# Altium schematic sheet MasterComm.SchDoc
size A4; SheetNumber: 1
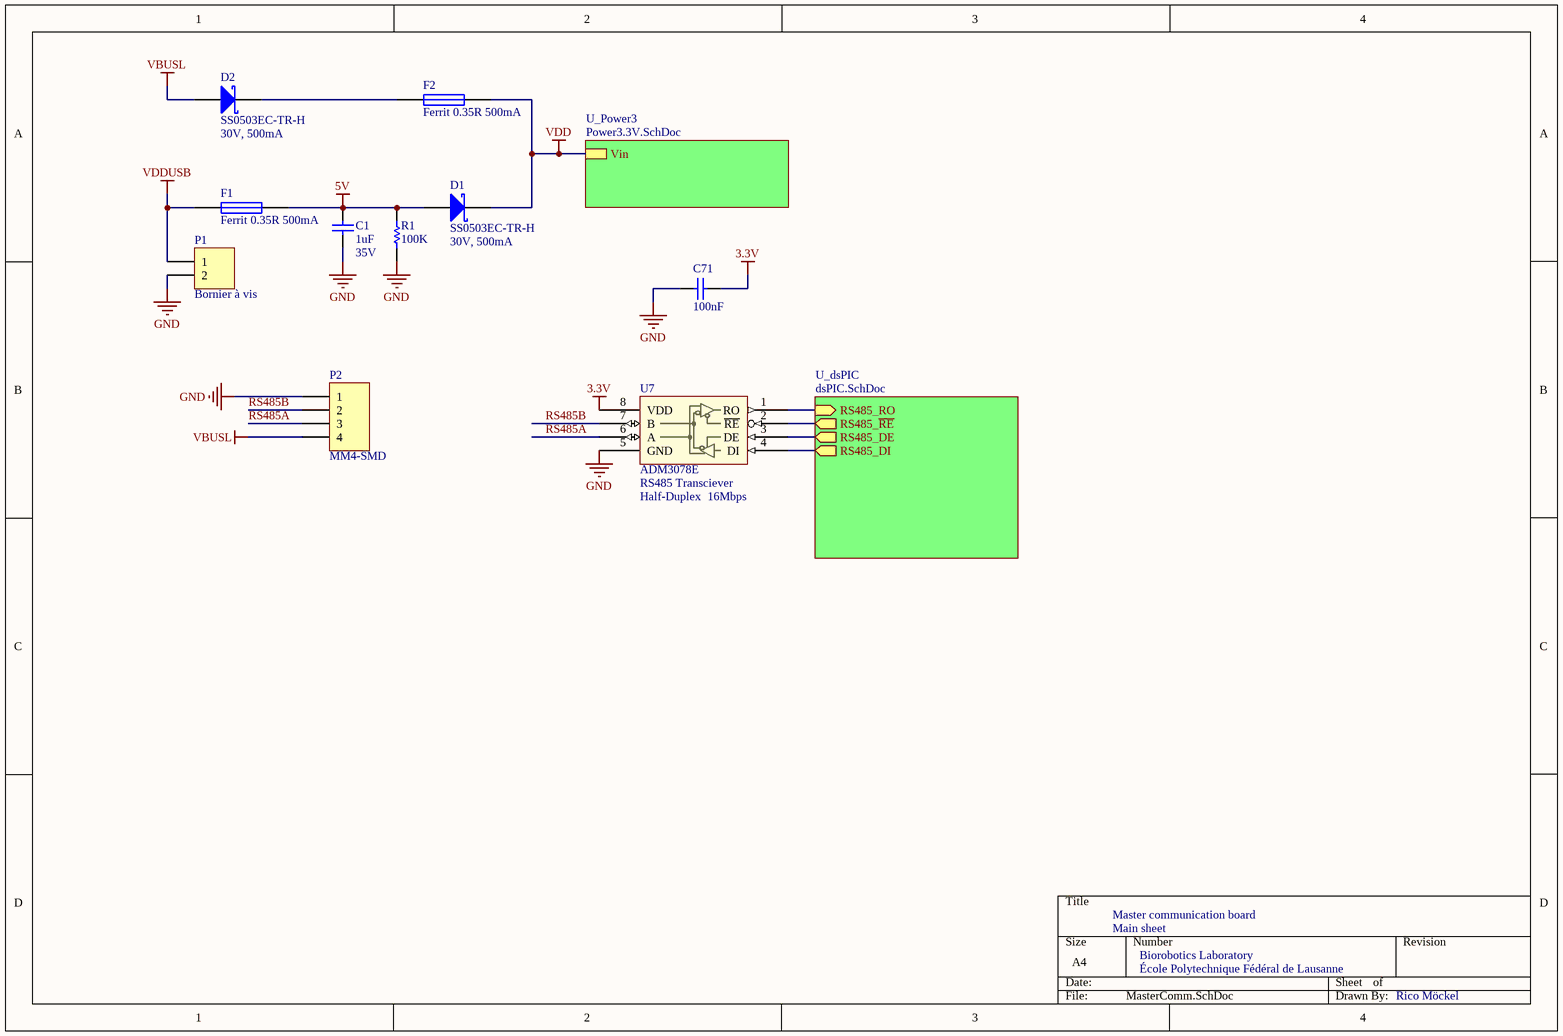
[diagram p0: MasterComm.SchDoc]

## Parts
C1  value 1uF  Voltage: 35V  [CAPC1608N]  (hidden comment: 1uF, 35V)
C71  100nF  [CAPC1005N]
D1  SS0503EC-TR-H  Values: 30V, 500mA  [RESC1005N]
D2  SS0503EC-TR-H  Values: 30V, 500mA  [RESC1005N]
F1  Ferrit 0.35R 500mA  [RESC1608N_R]
F2  Ferrit 0.35R 500mA  [RESC1608N_R]
P1  Bornier à vis  [CONN_100MIL_2]
P2  MM4-SMD  [MM4-SMD]
R1  100K  [RESC1005N]
U7  ADM3078E  [SOIC-8_M]

## Sub-sheets
U_dsPIC = dsPIC.SchDoc: RS485_RO (in), RS485_~{RE} (out), RS485_DE (out), RS485_DI (out)
U_Power3 = Power3.3V.SchDoc: Vin

## Nets
3.3V: C71.1 U7.8(VDD)
5V: C1.2 D1.1(A) F1.2 R1.1
GND: C1.1 C71.2 P1.2 P2.1 R1.2 U7.5(GND)
VBUSL: D2.1(A) P2.4
VDD: D1.2(K) F2.2 ; sheet U_Power3/Vin
VDDUSB: F1.1 P1.1
RS485A: P2.3 U7.6(A)
RS485B: P2.2 U7.7(B)
NetD2_2: D2.2(K) F2.1
NetU7_1: U7.1(RO) ; sheet U_dsPIC/RS485_RO
NetU7_2: U7.2(~{RE}) ; sheet U_dsPIC/RS485_~{RE}
NetU7_3: U7.3(DE) ; sheet U_dsPIC/RS485_DE
NetU7_4: U7.4(DI) ; sheet U_dsPIC/RS485_DI

## Notes on the sheet
- (near U7) RS485 Transciever
- (near U7) Half-Duplex
- (near U7) 16Mbps
- Master communication board
- Main sheet
- École Polytechnique Fédéral de Lausanne
- Biorobotics Laboratory
- Rico Möckel

## Library data of the parts
C1 C71 = Cap: Capacitor; Published: 8-Jun-2000; LatestRevisionDate: 17-Jul-2002; LatestRevisionNote: Re-released for DXP Platform.; Publisher: Altium Limited
  C1: PackageReference: 0603
  C71: PackageReference: RAD-0.3; Value: 100nF
D1 D2 = D Schottky: Schottky Diode; Published: 8-Jun-2000; LatestRevisionDate: 17-Jul-2002; LatestRevisionNote: Re-released for DXP Platform.; PackageReference: SMB; Publisher: Altium Limited; Code_JEDEC: DO-214-AA
F1 F2 = Fuse 1: Ferrit Bead; Published: 8-Jun-2000; LatestRevisionDate: 17-Jul-2002; LatestRevisionNote: Re-released for DXP Platform.; PackageReference: PIN-W2/E2.8; Publisher: Altium Limited
P1 = Header 2: Header, 2-Pin; LatestRevisionDate: 17-Jul-2002; LatestRevisionNote: Re-released for DXP Platform.; Publisher: Altium Limited
P2 = Header 4: Header, 4-Pin; LatestRevisionDate: 17-Jul-2002; LatestRevisionNote: Re-released for DXP Platform.; Publisher: Altium Limited
R1 = Res1: Resistor; Published: 8-Jun-2000; LatestRevisionDate: 17-Jul-2002; LatestRevisionNote: Re-released for DXP Platform.; PackageReference: AXIAL-0.3; Publisher: Altium Limited
U7 = ADM3078E: Half-Duplex RS485 Transciever, 3.3V, 16Mbps